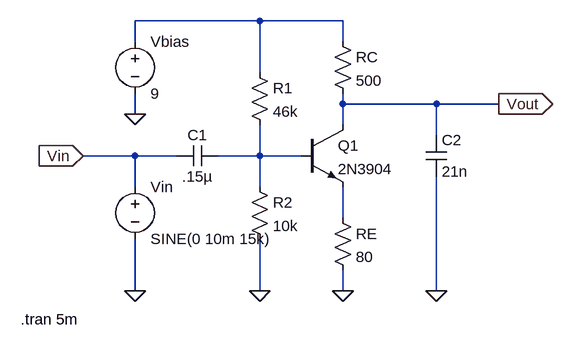
[diagram p0: schematic lab3.asc]
lab3.asc, the LTspice schematic file:
Version 4
SHEET 1 880 680
WIRE 160 -64 -32 -64
WIRE 288 -64 160 -64
WIRE -32 -32 -32 -64
WIRE 288 -32 288 -64
WIRE 160 16 160 -64
WIRE 288 64 288 48
WIRE 432 64 288 64
WIRE 528 64 432 64
WIRE -32 80 -32 48
WIRE 288 96 288 64
WIRE 432 112 432 64
WIRE -32 144 -112 144
WIRE 32 144 -32 144
WIRE 160 144 160 96
WIRE 160 144 96 144
WIRE 224 144 160 144
WIRE -32 192 -32 144
WIRE 160 192 160 144
WIRE 288 240 288 192
WIRE -32 352 -32 272
WIRE 160 352 160 272
WIRE 288 352 288 320
WIRE 432 352 432 176
FLAG 288 352 0
FLAG 160 352 0
FLAG 432 352 0
FLAG -32 352 0
FLAG -32 80 0
FLAG 528 64 Vout
IOPIN 528 64 Out
FLAG -112 144 Vin
IOPIN -112 144 In
SYMBOL npn 224 96 R0
SYMATTR InstName Q1
SYMATTR Value 2N3904
SYMBOL cap 96 128 R90
WINDOW 0 0 32 VBottom 2
WINDOW 3 32 32 VTop 2
SYMATTR InstName C1
SYMATTR Value .15µ
SYMBOL cap 416 112 R0
SYMATTR InstName C2
SYMATTR Value 21n
SYMBOL res 144 176 R0
SYMATTR InstName R2
SYMATTR Value 10k
SYMBOL res 144 0 R0
SYMATTR InstName R1
SYMATTR Value 46k
SYMBOL res 272 224 R0
SYMATTR InstName RE
SYMATTR Value 80
SYMBOL res 272 -48 R0
SYMATTR InstName RC
SYMATTR Value 500
SYMBOL voltage -32 176 R0
WINDOW 123 0 0 Left 2
WINDOW 39 0 0 Left 2
SYMATTR InstName Vin
SYMATTR Value SINE(0 10m 15k)
SYMBOL voltage -32 -48 R0
WINDOW 123 0 0 Left 2
WINDOW 39 0 0 Left 2
SYMATTR InstName Vbias
SYMATTR Value 9
TEXT -208 396 Left 2 !.tran 5m

The netlist it stands for:
* lab3.asc
Q1 Vout N002 N003 0 2N3904
C1 N002 Vin .15µ
C2 Vout 0 21n
R2 N002 0 10k
R1 N001 N002 46k
RE N003 0 80
RC N001 Vout 500
Vin Vin 0 SINE(0 10m 15k)
Vbias N001 0 9
.model NPN NPN
.model PNP PNP
.lib standard.bjt
.tran 5m
.backanno
.end